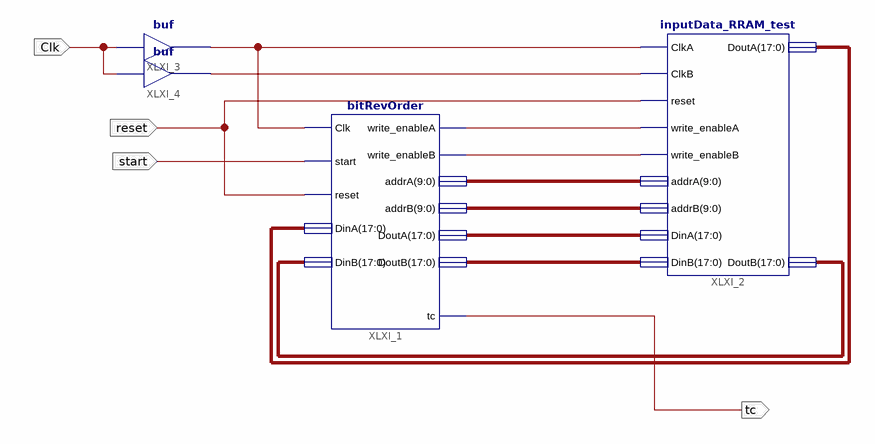
[diagram p0: schematic sheet 1]
// Xilinx ISE schematic bitRevOrderTest.sch (spartan6) as structural Verilog: 4 symbols, 4 ports
module bitRevOrderTest (
  input  Clk,
  input  start,
  input  reset,
  output tc
);

  wire XLXN_1, XLXN_2, XLXN_10, XLXN_11;
  wire [9:0] XLXN_3, XLXN_4;
  wire [17:0] XLXN_5, XLXN_6, XLXN_7, XLXN_8;

  bitRevOrder XLXI_1 (
    .Clk(XLXN_10), .start(start), .reset(reset), .DinA(XLXN_7), .DinB(XLXN_8), .write_enableA(XLXN_1),
    .write_enableB(XLXN_2), .addrA(XLXN_3), .addrB(XLXN_4), .DoutA(XLXN_5), .DoutB(XLXN_6), .tc(tc));
  inputData_RRAM_test XLXI_2 (
    .ClkA(XLXN_10), .ClkB(XLXN_11), .reset(reset), .write_enableA(XLXN_1), .write_enableB(XLXN_2),
    .addrA(XLXN_3), .addrB(XLXN_4), .DinA(XLXN_5), .DinB(XLXN_6), .DoutA(XLXN_7), .DoutB(XLXN_8));
  buf XLXI_3 (XLXN_10, Clk);
  buf XLXI_4 (XLXN_11, Clk);
endmodule
